# Altium schematic sheet MCUDebug.SchDoc
size A; SheetNumber: 8; SheetTotal: 11
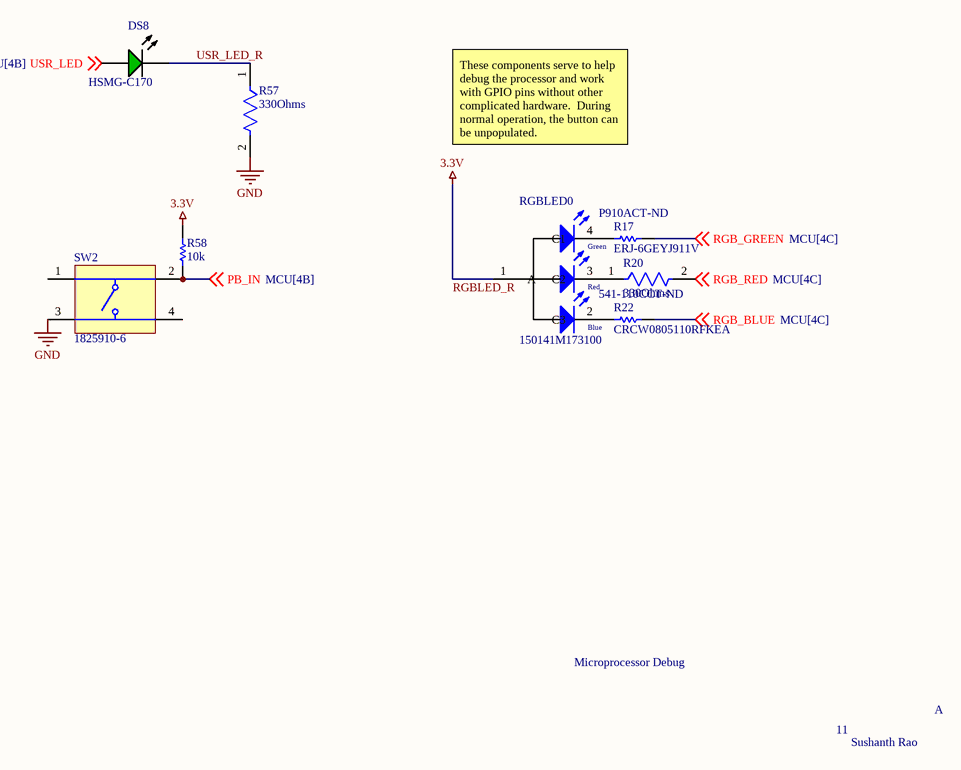
[diagram p0: MCUDebug.SchDoc]

## Parts
DS8  HSMG-C170  [AVAG-HSMX-C170_V]
R17  ERJ-6GEYJ911V  Supplier Part Number 1: P910ACT-ND  [RESC2013X70X40ML20T20]
R20  330Ohms  [FP-KTR10-IPC_C]
R22  CRCW0805110RFKEA  Supplier Part Number 1: 541-110CCT-ND  [RESC2013X50X30ML20T20]
R57  330Ohms  [FP-KTR10-IPC_C]
R58  10k  [RESC2013X60X35NL10T20]
RGBLED0  150141M173100  [3528_A]
SW2  1825910-6  [TECO-1825910-6_V]

## Nets
GND: R57.2 SW2.3
RGBLED_R: R58.2 RGBLED0.1(A)  [also labelled 3.3V]
PB_IN: R58.1 SW2.2 ; off-sheet PB_IN
RGB_BLUE: R22.2 ; off-sheet RGB_BLUE
RGB_GREEN: R17.2 ; off-sheet RGB_GREEN
RGB_RED: R20.2 ; off-sheet RGB_RED
USR_LED: DS8.1(A) ; off-sheet USR_LED
USR_LED_R: DS8.2(K) R57.1
NetR17_1: R17.1 RGBLED0.4(C1)
NetR20_1: R20.1 RGBLED0.3(C2)
NetR22_1: R22.1 RGBLED0.2(C3)

Not connected (* = marked no-connect by the designer): SW2 1 4

## Notes on the sheet
- These components serve to help debug the processor and work with GPIO pins without other complicated hardware.  During normal operation, the button can be unpopulated.
- Microprocessor Debug
- 11
- A
- Sushanth Rao
- (in symbol CMP-1431-00001-1) Green; Red; Blue

## Library data of the parts
DS8 = CMP-2000-05062-1: Chip LED, Green, 2.2 V, -40 to 85 degC, 2-Pin SMD, Pb-Free, Tape and Reel; Manufacturer: Avago; No. of Pins: 2; Peak Wavelength: 570nm; SVHC: NoSVHC(16-Jun-2014); Dominant Wavelength: 572nm; Forward Current If: 20mA; Viewing Angle: 170deg; Lens Shape: Rectangular; PIV Max: 5V; External Width: 1.25mm; LED Type: Standard; External Depth: 0.8mm; Opto Mounting Orientation: Top; Luminous Intensity: 15mcd; Luminous Intensity Min: 4mcd; Forward Voltage VF Max: 2.6V; External Length / Height: 2mm; Bulb Size: 1.25mmx1.4mm; Light Area Height: 1mm; Voltage Vf Typ: 2.2V; Operating Temperature Max: 85degC; Datasheet Version: Oct-08; MSL: MSL2A-4weeks; Peak Forward Current: 20mA; Package Description: 2-Pin Surface Mount Device, Body 2 x 1.25 mm, Height 0.8 mm; Datasheet URL: https://datasheet.ciiva.com/29280/180495-da-01-en-chip-led-hsmg-c170-gelb-gruen-29280971.pdf; Storage Temperature Min: -40degC; LED Colour: Green; Wavelength Typ: 570nm; Mounting Type: SMD; Forward Current If Max: 20mA; Dominant Wavelength Typ: 572nm; LED Mounting: SMD; Operating Temperature Range: -30degCto+85degC; Operating Temperature Min: -30degC; Manufacturer URL: http://www.avagotech.com/; Packaging: CutTape; Luminous Intensity Typ: 15mcd; Package Reference: HSMX-C170; Storage Temperature Max: 85degC; Opto Case Style: SMD; Forward Voltage: 2.2V
R17 = CMP-2001-00455-1: Manufacturer: Panasonic; Description: Fixed Resistor, Metal Glaze/thick Film, 0.125W, 910ohm, 150V, 5% +/-Tol, 200ppm/Cel, Surface Mount, 0805; Tolerance: 5%; Rated Power Dissipation (P): 125mW; Rated Temperature: 70°C; Resistance: 910R; Temperature Coefficient: 200ppm/°C; Working Voltage: 150V; Package Height: 0.6mm; Package Length: 2mm; Package Width: 1.25mm; Reference Standard: AEC-Q200; Part Number: ERJ-6GEYJ911V; Supplier 1: Digi-Key; Manufacturer Part Number: ERJ-6GEYJ911V; RoHS: Yes; Category: Chip SMD Resistors; Stock 1: 32792; Pricing 1: 1=0.10000, 10=0.06800, 100=0.02780, 1000=0.01251, 2500=0.01086 (USD); Mount: Surface Mount; Number of Pins: 2; Size Code: 0805; Terminal Finish: Nickel; Package Shape: Rectangular; Min Operating Temperature: -55°C; Max Operating Temperature: 155°C; JESD-609 Code: e3; Resistor Type: FIXED RESISTOR; Construction: Rectangular; Package Style: SMTMeter; Packaging: Tape and Reel; Technology: METAL GLAZE/THICK FILM; Termination: Wraparound; Reach SVHC Compliant: Yes; RoHS Compliant: Yes; ComponentLink1URL: https://datasheet.ciiva.com:443/pdfs/VipMasterIC/IC/PANA/PANA-S-A0009891627/PANA-S-A0009891627-1.pdf?src-supplier=IHS+Markit; ComponentLink1Description: https://datasheet.ciiva.com:443/pdfs/VipMasterIC/IC/PANA/PANA-S-A0009891627/PANA-S-A0009891627-1.pdf?src-supplier=IHS+Markit; ComponentLink2URL: https://datasheet.ciiva.com/11821/0900766b80f806dd-11821702.pdf?src-supplier=Rs; ComponentLink2Description: https://datasheet.ciiva.com/11821/0900766b80f806dd-11821702.pdf?src-supplier=Rs; ComponentLink3URL: https://datasheet.ciiva.com/43469/1678796-43469673.pdf?src-supplier=Farnell; ComponentLink3Description: https://datasheet.ciiva.com/43469/1678796-43469673.pdf?src-supplier=Farnell; ComponentLink4URL: https://datasheet.ciiva.com/46379/1678796-46379902.pdf?src-supplier=Element14; ComponentLink4Description: https://datasheet.ciiva.com/46379/1678796-46379902.pdf?src-supplier=Element14; ComponentLink5URL: https://datasheet.ciiva.com/24024/aoa0000ce1-37422-24024872.pdf?src-supplier=Mouser; ComponentLink5Description: https://datasheet.ciiva.com/24024/aoa0000ce1-37422-24024872.pdf?src-supplier=Mouser; ComponentLink6URL: https://datasheet.ciiva.com/9179/aoa0000ce1-9179466.pdf?src-supplier=Avnet; ComponentLink6Description: https://datasheet.ciiva.com/9179/aoa0000ce1-9179466.pdf?src-supplier=Avnet
R20 R57 = CMP-08839-031445-1: Res Thick Film 0805 300Ω 5% 0.125W ±200ppm/°C Automotive Paper T/R; Max Power Dissipation: 125mW; Resistance: 300R; Resistor Type: Thick Film; Case Code (Metric): 2012; Length: 0.079inch; Package Quantity: 1; Case Code (Imperial): 0805; Max Operating Temperature: 155°C; Number of Terminations: 2; Features: Automotive AEC-Q200; Temperature Coefficient: 200ppm/°C; Case/Package: 0805; Tolerance: 5%; Min Operating Temperature: -55°C; Packaging: Cut Tape; Height: 0.026inch; Series: KTR; RoHS Compliant: Yes; Width: 0.049inch
R22 = CMP-2001-04919-1: Manufacturer: Vishay Dale; Description: Fixed Resistor, Metal Glaze/thick Film, 0.125W, 110ohm, 150V, 1% +/-Tol, 100ppm/Cel, Surface Mount, 0805; Tolerance: 1%; Rated Power Dissipation (P): 125mW; Resistance: 110R; Temperature Coefficient: 100ppm/°C; Working Voltage: 150V; Rated Temperature: 70°C; Package Height: 0.45mm; Package Length: 2mm; Package Width: 1.25mm; Reference Standard: AEC-Q200; Part Number: CRCW0805110RFKEA; Supplier 1: Digi-Key; Manufacturer Part Number: CRCW0805110RFKEA; RoHS: Yes; Category: Chip SMD Resistors; Stock 1: 6355; Pricing 1: 1=0.10000, 10=0.06700, 100=0.02710, 1000=0.01219, 2500=0.01058 (USD); Mount: Surface Mount; Number of Pins: 2; Size Code: 0805; Terminal Finish: Nickel; Package Shape: Rectangular; Min Operating Temperature: -55°C; Max Operating Temperature: 155°C; Resistor Type: FIXED RESISTOR; Packaging: Tape and Reel; Construction: Chip; Package Style: SMTMeter; Technology: METAL GLAZE/THICK FILM; Termination: Wraparound; JESD-609 Code: e3; RoHS Compliant: Yes; Reach SVHC Compliant: Yes; ComponentLink1URL: https://datasheet.ciiva.com:443/pdfs/VipMasterIC/IC/VISH/VISH-S-A0007266705/VISH-S-A0007266705-1.pdf?src-supplier=IHS+Markit; ComponentLink1Description: https://datasheet.ciiva.com:443/pdfs/VipMasterIC/IC/VISH/VISH-S-A0007266705/VISH-S-A0007266705-1.pdf?src-supplier=IHS+Markit; ComponentLink2URL: https://datasheet.ciiva.com/11810/0900766b80d98b26-11810458.pdf?src-supplier=Rs; ComponentLink2Description: https://datasheet.ciiva.com/11810/0900766b80d98b26-11810458.pdf?src-supplier=Rs; ComponentLink3URL: https://datasheet.ciiva.com/2467/dcrcwe3-2467311.pdf?src-supplier=Digi-Key; ComponentLink3Description: https://datasheet.ciiva.com/2467/dcrcwe3-2467311.pdf?src-supplier=Digi-Key; ComponentLink4URL: https://datasheet.ciiva.com/2467/dcrcwe3-2467312.pdf?src-supplier=Digi-Key; ComponentLink4Description: https://datasheet.ciiva.com/2467/dcrcwe3-2467312.pdf?src-supplier=Digi-Key; ComponentLink5URL: https://datasheet.ciiva.com/2467/dcrcwe3-2467313.pdf?src-supplier=Digi-Key; ComponentLink5Description: https://datasheet.ciiva.com/2467/dcrcwe3-2467313.pdf?src-supplier=Digi-Key; ComponentLink6URL: https://datasheet.ciiva.com/26317/fld-crcw-e3-data-en-26317333.pdf?src-supplier=Distrelec; ComponentLink6Description: https://datasheet.ciiva.com/26317/fld-crcw-e3-data-en-26317333.pdf?src-supplier=Distrelec; ComponentLink7URL: https://datasheet.ciiva.com/5544/dcrcwe3-109170-5544341.pdf?src-supplier=Mouser; ComponentLink7Description: https://datasheet.ciiva.com/5544/dcrcwe3-109170-5544341.pdf?src-supplier=Mouser; ComponentLink8URL: https://datasheet.ciiva.com/16427/dcrcw-16427135.pdf?src-supplier=Future+Electronics; ComponentLink8Description: https://datasheet.ciiva.com/16427/dcrcw-16427135.pdf?src-supplier=Future+Electronics; ComponentLink9URL: https://datasheet.ciiva.com/22707/1697337-22707370.pdf?src-supplier=Element14; ComponentLink9Description: https://datasheet.ciiva.com/22707/1697337-22707370.pdf?src-supplier=Element14
R58 = CMP-1659-00013-4: Chip Resistor, 10 KOhm, +/- 1%, 0.125 W, -55 to 155 degC, 0805 (2012 Metric), RoHS, Tape and Reel; Manufacturer: Yageo; Manufacturer Part Number: RC0805FR-0710KL; Voltage Rating: 150 V; Value: 10kR; Power Rating: 125mW; Temperature Coefficient: 100ppm/°C; Mount: Surface Mount; ComponentLink1Description: Manufacturer URL; ComponentLink2URL: http://www.yageo.com/documents/recent/PYu-RC_Group_51_RoHS_L_04.pdf; Pins: 2; Length: 2 mm; Min Operating Temperature: -55 degC; Height: 0.5 mm; Mounting Technology: Surface Mount; RoHSCompliant: true; REACH SVHC: No SVHC; ComponentLink1URL: http://www.yageo.com/; Max Operating Temperature: 155 degC; PackageReference: 0805; DatasheetVersion: Rev. 4, 02/2016; Package Quantity: 5000; Packaging: Tape and Reel; ComponentLink2Description: Datasheet; PackageDescription: 2-Pin Surface Mounted Device, Body 2 x 1.25 mm; Supplier 1: Digi-Key; Supplier Part Number 1: 311-10.0KCRCT-ND; RoHS: Yes; Category: Chip SMD Resistors; Stock 1: 11227289; Pricing 1: 1=0.10000, 10=0.03300, 100=0.01340, 1000=0.00602, 2500=0.00523 (USD); Case/Package: 0805; Case Code (Imperial): 0805; Case Code (Metric): 2012; Tolerance: 1%; Termination: SMD/SMT; Series: RC; Resistance Tolerance: 1%; Resistor Type: Thick Film; Number of Terminations: 2; Max Power Dissipation: 125mW; Construction: Rectangular; Technology: THICK FILM; Features: Moisture Resistant; Width: 0.049inch; Depth: 1.25mm; Lead Free: Lead Free; RoHS Compliant: Yes; Military Standard: Not
RGBLED0 = CMP-1431-00001-1: SMD Full-Color Top LED, WL-SFTW, Red & Green & Blue; Manufacturer: Wuerth Elektronik; PackageReference: 3528_A; PartNumber: 150141M173100; ComponentLink2Description: Datasheet; ComponentLink1URL: http://www.we-online.com; Color: Red & Green & Blue; ComponentLink1Description: Manufacturer URL; ComponentLink2URL: http://katalog.we-online.com/led/datasheet/150141M173100.pdf
SW2 = CMP-1684-00021-1: Tact Switch, SPST-NO, 0.05 A, -35 to 85 degC, 4-Pin THD, RoHS, Bulk; Manufacturer: TE Connectivity; Maximum Contact Resistance: 100mOhm; Mechanical Life: 100000Cycles; Bushing Type: Unthreaded; Switch Configuration: OFF(ON); Maximum DC Voltage Rating: 24V; Contact Rating @ Voltage: 0.05A@24VDC; Actuator Color: Black; Body Orientation: Straight; Function: MomentaryContact; Illumination: N/R; Actuator Style: RoundButton; Actuator Material: PolybutyleneTerephthalate; Dielectric Strength: 500VAC; Pole Throw Configuration: SPST; Actuator Length: 1.4mm; Product Weight: N/A; Contact Material: CopperAlloy; Housing Material: N/A; Terminal Type: PCPins; Minimum Insulation Resistance: 100MOhm; Package Description: 4-Pin Through Hole Device, Body 5.99 x 5.99 mm, Pitch 6.5 mm; Part No: 1825910-6; Package Reference: THD; Base Material: N/A; Manufacturer URL: http://www.te.com; Contact Plating: Silver; RoHS: Yes; Datasheet Version: Rev. C9; Electrical Life: 100000Cycles; Maximum AC Voltage Rating: N/A; Thread Size: N/R; Operating Temperature: -35to85C; Mounting: ThroughHole; Dimension: 5.99x5mm; Datasheet URL: http://www.te.com/commerce/DocumentDelivery/DDEController?Action=showdoc&DocId=Customer+Drawing%7F1825910%7FC9%7Fpdf%7FEnglish%7FENG_CD_1825910_C9.pdf%7F1825910-6; Family: 1825910; Seal Location: N/A; Seal Description: N/A; Packaging: N/A